# Altium schematic sheet I2C_MUX.SchDoc: =ProjectName
size 420 x 297 mm; Author: T.P.; CompanyName: WUT; DrawnBy: T.P.; Organization: WUT ISE; Address1: Warsaw Univeristy of Technology; Address2: Nowowiejska 15/19; DocumentNumber: 34; Revision: 0.9; SheetNumber: 34; SheetTotal: 36; EDA_Number: ARTIQ; Projet: ARTIQ/SINARA; ModifiedBy: -; CreateDate: XX/XX/XXXX; CheckedDate: -; Title2: I2C_MUX.SchDoc; DivGrp: ISE; Designer: G.K. and T.P.; ModifiedDate: -; ProjectName: ADC/DAC MEZZANINE
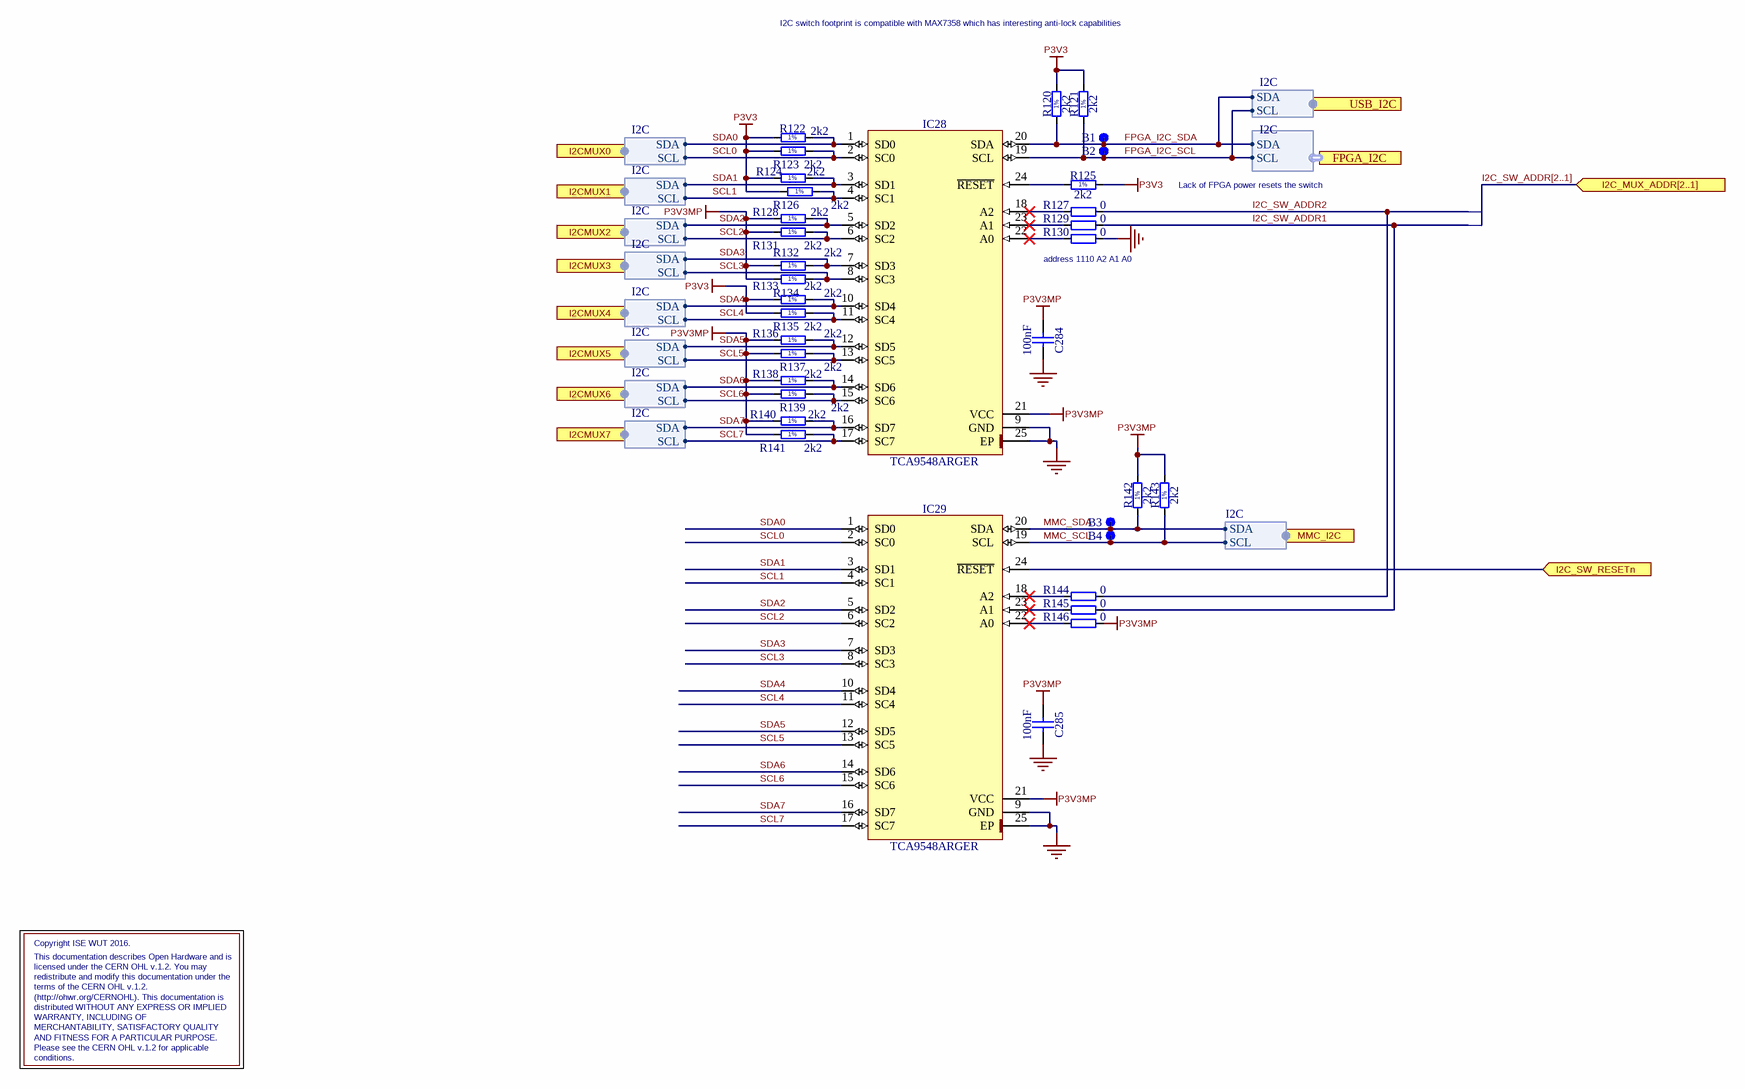
[diagram p0: I2C_MUX.SchDoc]

## Parts
B1  SMD Pad  [C100]  (value not drawn)
B2  SMD Pad  [C100]  (value not drawn)
B3  SMD Pad  [C100]  (value not drawn)
B4  SMD Pad  [C100]  (value not drawn)
C284  100nF  [CAPC0603X33N]
C285  100nF  [CAPC0603X33N]
IC28  TCA9548ARGER  [QFN50P400X400X100-25N-S220]
IC29  TCA9548ARGER  [QFN50P400X400X100-25N-S220]
R120  2k2  [RESC1005X40N]
R121  2k2  [RESC1005X40N]
R122  2k2  [RESC1005X40N]
R123  2k2  [RESC1005X40N]
R124  2k2  [RESC1005X40N]
R125  2k2  [RESC1005X40N]
R126  2k2  [RESC1005X40N]
R127  0  [RESC1005X40N]
R128  2k2  [RESC1005X40N]
R129  0  [RESC1005X40N]
R130  0  [RESC1005X40N]
R131  2k2  [RESC1005X40N]
R132  2k2  [RESC1005X40N]
R133  2k2  [RESC1005X40N]
R134  2k2  [RESC1005X40N]
R135  2k2  [RESC1005X40N]
R136  2k2  [RESC1005X40N]
R137  2k2  [RESC1005X40N]
R138  2k2  [RESC1005X40N]
R139  2k2  [RESC1005X40N]
R140  2k2  [RESC1005X40N]
R141  2k2  [RESC1005X40N]
R142  2k2  [RESC1005X40N]
R143  2k2  [RESC1005X40N]
R144  0  [RESC1005X40N]
R145  0  [RESC1005X40N]
R146  0  [RESC1005X40N]

## Ports
FPGA_I2C (harness I2C), I2C_MUX_ADDR[2..1] (in), I2C_SW_RESETn (in), I2CMUX0 (harness I2C), I2CMUX1 (harness I2C), I2CMUX2 (harness I2C), I2CMUX3 (harness I2C), I2CMUX4 (harness I2C), I2CMUX5 (harness I2C), I2CMUX6 (harness I2C), I2CMUX7 (harness I2C), MMC_I2C (harness I2C), USB_I2C (harness I2C)

## Harnesses
I2C: SCL, SDA

## Nets
GND: C284.2 C285.2 IC28.9(GND) IC28.25(EP) IC29.9(GND) IC29.25(EP) R130.1
P3V3: R120.2 R121.2 R122.1 R123.1 R124.1 R125.1 R126.1 R134.1 R135.1
P3V3MP: C284.1 C285.1 IC28.21(VCC) IC29.21(VCC) R128.1 R131.1 R132.1 R133.1 R136.1 R137.1 R138.1 R139.1 R140.1 R141.1 R142.2 R143.2 R146.1
FPGA_I2C_SCL: B2.1 IC28.19(SCL) R121.1 ; port FPGA_I2C.SCL, port USB_I2C.SCL
FPGA_I2C_SDA: B1.1 IC28.20(SDA) R120.1 ; port FPGA_I2C.SDA, port USB_I2C.SDA
I2C_SW_ADDR1: R129.1 R145.1
I2C_SW_ADDR2: R127.1 R144.1
I2C_SW_RESETn: IC29.24(~{RESET}) ; port I2C_SW_RESETn
MMC_SCL: B4.1 IC29.19(SCL) R143.1 ; port MMC_I2C.SCL
MMC_SDA: B3.1 IC29.20(SDA) R142.1 ; port MMC_I2C.SDA
SCL0: IC28.2(SC0) IC29.2(SC0) R123.2 ; port I2CMUX0.SCL
SCL1: IC28.4(SC1) IC29.4(SC1) R126.2 ; port I2CMUX1.SCL
SCL2: IC28.6(SC2) IC29.6(SC2) R131.2 ; port I2CMUX2.SCL
SCL3: IC28.8(SC3) IC29.8(SC3) R133.2 ; port I2CMUX3.SCL
SCL4: IC28.11(SC4) IC29.11(SC4) R135.2 ; port I2CMUX4.SCL
SCL5: IC28.13(SC5) IC29.13(SC5) R137.2 ; port I2CMUX5.SCL
SCL6: IC28.15(SC6) IC29.15(SC6) R139.2 ; port I2CMUX6.SCL
SCL7: IC28.17(SC7) IC29.17(SC7) R141.2 ; port I2CMUX7.SCL
SDA0: IC28.1(SD0) IC29.1(SD0) R122.2 ; port I2CMUX0.SDA
SDA1: IC28.3(SD1) IC29.3(SD1) R124.2 ; port I2CMUX1.SDA
SDA2: IC28.5(SD2) IC29.5(SD2) R128.2 ; port I2CMUX2.SDA
SDA3: IC28.7(SD3) IC29.7(SD3) R132.2 ; port I2CMUX3.SDA
SDA4: IC28.10(SD4) IC29.10(SD4) R134.2 ; port I2CMUX4.SDA
SDA5: IC28.12(SD5) IC29.12(SD5) R136.2 ; port I2CMUX5.SDA
SDA6: IC28.14(SD6) IC29.14(SD6) R138.2 ; port I2CMUX6.SDA
SDA7: IC28.16(SD7) IC29.16(SD7) R140.2 ; port I2CMUX7.SDA
NetIC28_18: IC28.18(A2) R127.2
NetIC28_22: IC28.22(A0) R130.2
NetIC28_23: IC28.23(A1) R129.2
NetIC28_24: IC28.24(~{RESET}) R125.2
NetIC29_18: IC29.18(A2) R144.2
NetIC29_22: IC29.22(A0) R146.2
NetIC29_23: IC29.23(A1) R145.2

## Buses and harness runs
bus I2C_SW_ADDR[2..1] = port I2C_MUX_ADDR[2..1]

## Notes on the sheet
- I2C switch footprint is compatible with MAX7358 which has interesting anti-lock capabilities
- Lack of FPGA power resets the switch
- (near R130) address 1110 A2 A1 A0
- Copyright ISE WUT 2016.
- This documentation describes Open Hardware and is
- licensed under the CERN OHL v.1.2. You may
- distributed WITHOUT ANY EXPRESS OR IMPLIED
- terms of the CERN OHL v.1.2.
- WARRANTY, INCLUDING OF
- redistribute and modify this documentation under the
- (http://ohwr.org/CERNOHL). This documentation is
- MERCHANTABILITY, SATISFACTORY QUALITY
- conditions.
- Please see the CERN OHL v.1.2 for applicable
- AND FITNESS FOR A PARTICULAR PURPOSE.
- Project/Equipment
- Document
- Designer
- Drawn by
- Check.by
- File
- Last Mod.
- Print Date
- Sheet
- Size
- A3
- of
- Rev
- (in symbol R0402_2K2_1%_0.0625W_100PPM) 1%

## Library data of the parts
B1-B4 = SMD_PAD_D1MM: Through Hole Pad; Part Description: 1mm Diameter SMD Pad; Mounted: No; Part Number: SMD_PAD_D1MM; Component Kind: Standard (No BOM); Component Type: Standard (No BOM); Pin Count: 1; Family: SMD Pad; Socket: No; SMD: No; Sense: No; Status: None; ComponentHeight: 0mm; HelpURL: Undefined; Author: CERN DEM JLC; CreateDate: 10.10.2017; LatestRevisionDate: 10.10.2017; PackageDescription: 1mm Diameter SMD Pad
C284 C285 = CC0201_100NF_6.3V_10%_X5R: Non-polarised capacitor; Manufacturer: GENERIC; Part Description: SMD Multilayer Chip Ceramic Capacitor; Manufacturer1 Part Number: 02016D104KAT2A; Tolerance: ±10%; Voltage: 6.3V; TC: X5R; Manufacturer Part Number: CC0201_100NF_6.3V_10%_X5R; Part Number: CC0201_100NF_6.3V_10%_X5R; Value: 100nF; Component Kind: Standard; Component Type: Standard; Pin Count: 2; Status: Not Recommended; Case: 0201; Mounted: Yes; Socket: No; SMD: Yes; Sense: No; Manufacturer1 Example: AVX; Manufacturer1 ComponentHeight: 0.33mm; HelpURL: \\cern.ch\dfs\Applications\Altium\Datasheets\CC0201_X5R_AVX.pdf; Author: CERN DEM JLC; CreateDate: 03.12.2007; LatestRevisionDate: 03.12.2007
IC28 IC29 = TCA9548ARGER: Low Voltage 8-Channel I2C Switch With Reset; Manufacturer: TEXAS INSTRUMENTS; PressFit: No; Bonding: No; Manufacturer Part Number: TCA9548ARGER; PackageDescription: QFN, 0.50mm Pitch, Square; 24 Pin, 4.00mm L X 4.00mm W X 1.00mm H body (w/thermal tab 2.2 X 2.2mm), IPC Medium Density; Part Description: Low Voltage 8-Channel I2C Switch With Reset; Part Number: TCA9548ARGER; Component Kind: Standard; Component Type: Standard; Device: TCA9548ARGER; Pin Count: 25; Case: QFN24; Mounted: Yes; Socket: No; SMD: Yes; Sense: No; ComponentHeight: 1mm; Author: CERN DEM JLC; HelpURL: \\cern.ch\dfs\Applications\Altium\Datasheets\TCA9548ARGER.pdf; CreateDate: 07.07.2014; LatestRevisionDate: 07.07.2014
R120-R126 R128 R131-R143 = R0402_2K2_1%_0.0625W_100PPM: Resistor - 1%; Manufacturer: GENERIC; Part Description: General Purpose Thick Film Chip Resistor; Manufacturer1 Part Number: 232270672202L; TC: ±100ppm/°C; PressFit: No; Manufacturer Part Number: R0402_2K2_1%_0.0625W_100PPM; Part Number: R0402_2K2_1%_0.0625W_100PPM; Tolerance: ±1%; Value: 2k2; Component Kind: Standard; Component Type: Standard; Pin Count: 2; Status: Not Recommended; Power: 0.0625W; Case: 0402; Mounted: Yes; Sense: No; Socket: No; SMD: Yes; Manufacturer1 Example: YAGEO PHYCOMP; Manufacturer1 ComponentHeight: 0.4mm; HelpURL: \\cern.ch\dfs\Applications\Altium\Datasheets\R0402_Phycomp_RC0402.pdf; Author: CERN DEM JLC; CreateDate: 03.12.2007; LatestRevisionDate: 17.10.2012
R127 R129 R130 R144-R146 = R0402_0R_JUMPER: Resistor; Manufacturer: GENERIC; Part Description: 1A (0.05R Max DC Resistance) Zero Ohm Jumper; Manufacturer1 Part Number: 232270591001L; PressFit: No; Manufacturer Part Number: R0402_0R_JUMPER; Part Number: R0402_0R_JUMPER; Value: 0; Component Kind: Standard; Component Type: Standard; Pin Count: 2; Status: Not Recommended; Case: 0402; Mounted: Yes; Sense: No; Socket: No; SMD: Yes; Manufacturer1 Example: YAGEO PHYCOMP; Manufacturer1 ComponentHeight: 0.4mm; HelpURL: \\cern.ch\dfs\Applications\Altium\Datasheets\R0402_Phycomp_RC0402.pdf; Author: CERN DEM JLC; CreateDate: 03.12.2007; LatestRevisionDate: 17.10.2012